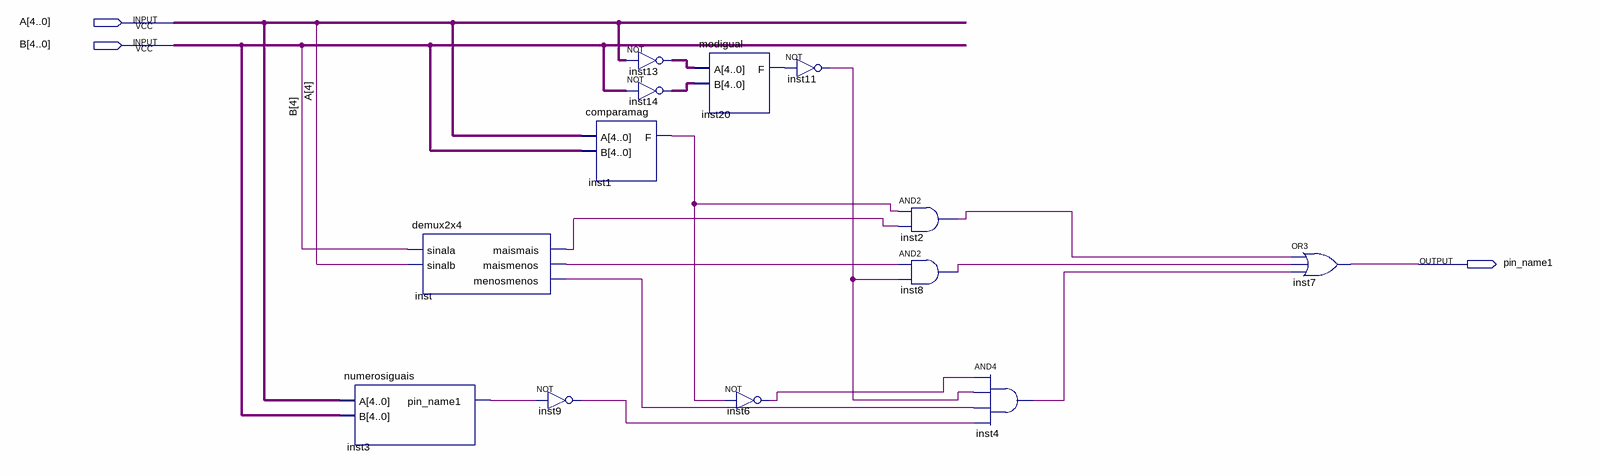
[diagram p0: schematic sheet]
// Quartus schematic AmaiorB.bdf as structural Verilog: 13 symbols, 3 pins
module AmaiorB (
  input  [4:0] A,
  input  [4:0] B,
  output pin_name1
);

  wire inst1_f, inst2_out, inst3_pin_name1, inst4_out, inst6_out, inst8_out, inst9_out, inst11_out, inst20_f,
       inst_maismais, inst_maismenos, inst_menosmenos;
  wire [4:0] inst13_out, inst14_out;

  numerosiguais inst3 (.A(A), .B(B), .pin_name1(inst3_pin_name1));
  demux2x4 inst (
    .sinala(B[4]), .sinalb(A[4]), .maismais(inst_maismais), .maismenos(inst_maismenos),
    .menosmenos(inst_menosmenos));
  not inst9 (inst9_out, inst3_pin_name1);
  assign inst13_out = ~A;  // NOT inst13, 5 bits wide
  assign inst14_out = ~B;  // NOT inst14, 5 bits wide
  comparamag inst1 (.A(A), .B(B), .F(inst1_f));
  modigual inst20 (.A(inst13_out), .B(inst14_out), .F(inst20_f));
  not inst6 (inst6_out, inst1_f);
  not inst11 (inst11_out, inst20_f);
  and inst2 (inst2_out, inst1_f, inst_maismais);
  and inst8 (inst8_out, inst_maismenos, inst11_out);
  and inst4 (inst4_out, inst6_out, inst11_out, inst_menosmenos, inst9_out);
  or inst7 (pin_name1, inst2_out, inst8_out, inst4_out);
endmodule
